# Altium schematic sheet Signal_generator.SchDoc
size A3
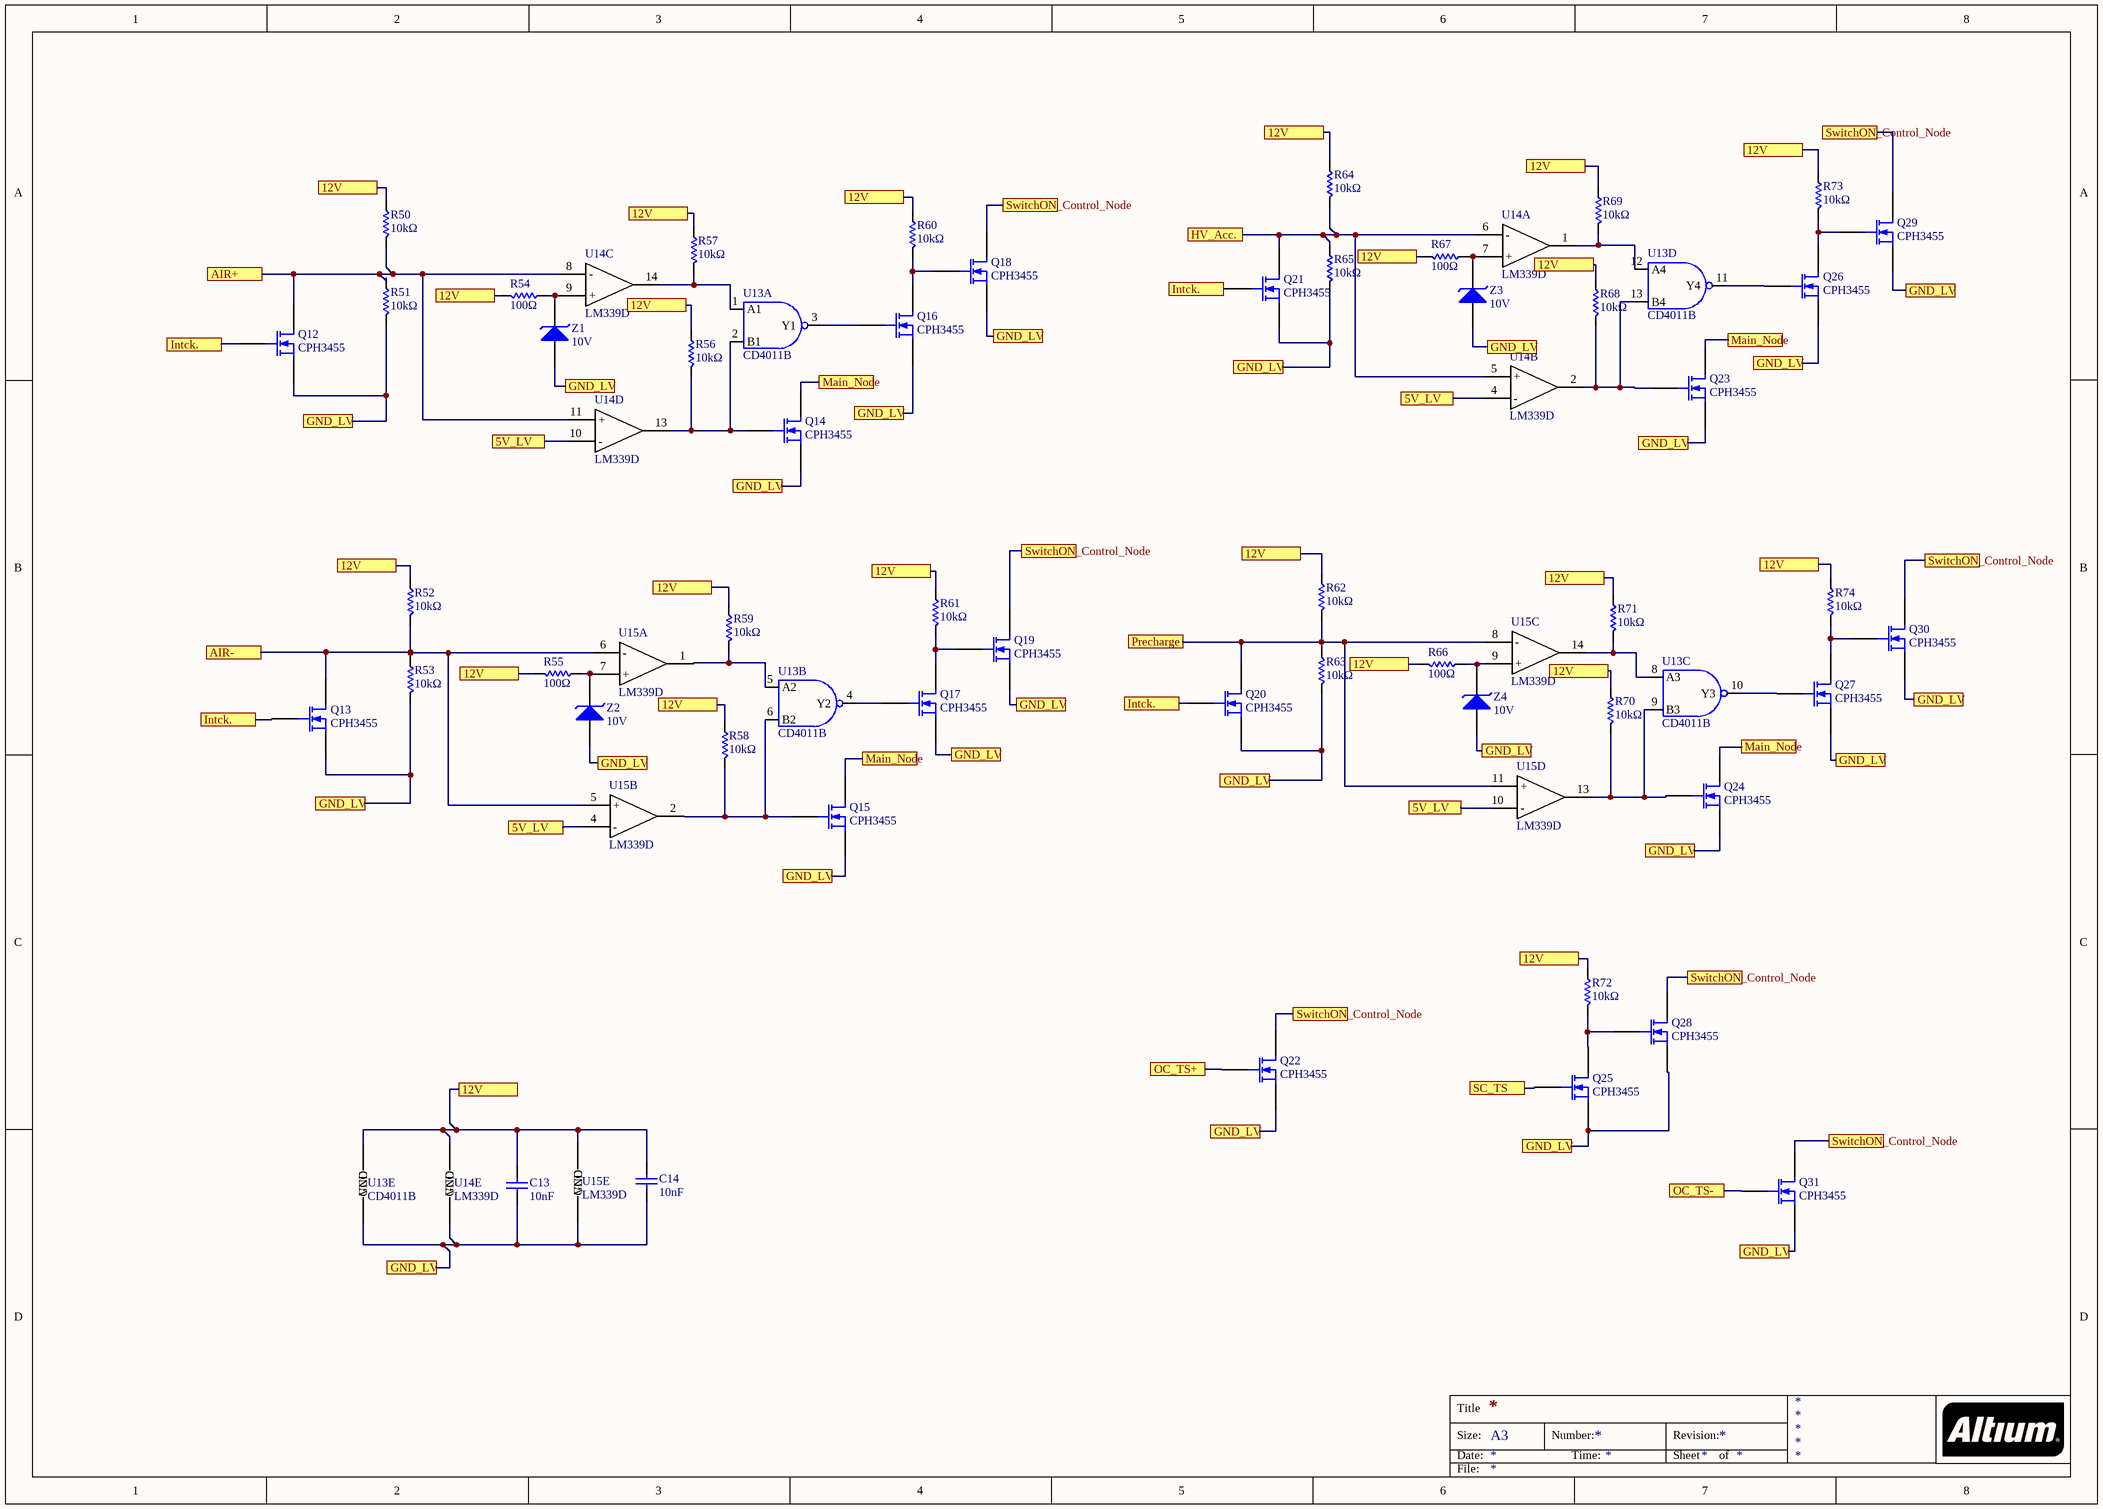
[diagram p0: Signal_generator.SchDoc]

## Parts
C13  10nF  [0805_2x1.25x0.8mm_Reflow Soldering]
C14  10nF  [0805_2x1.25x0.8mm_Reflow Soldering]
Q12  CPH3455  [CPH3455]
Q13  CPH3455  [CPH3455]
Q14  CPH3455  [CPH3455]
Q15  CPH3455  [CPH3455]
Q16  CPH3455  [CPH3455]
Q17  CPH3455  [CPH3455]
Q18  CPH3455  [CPH3455]
Q19  CPH3455  [CPH3455]
Q20  CPH3455  [CPH3455]
Q21  CPH3455  [CPH3455]
Q22  CPH3455  [CPH3455]
Q23  CPH3455  [CPH3455]
Q24  CPH3455  [CPH3455]
Q25  CPH3455  [CPH3455]
Q26  CPH3455  [CPH3455]
Q27  CPH3455  [CPH3455]
Q28  CPH3455  [CPH3455]
Q29  CPH3455  [CPH3455]
Q30  CPH3455  [CPH3455]
Q31  CPH3455  [CPH3455]
R50  10kΩ  [CR0805]
R51  10kΩ  [CR0805]
R52  10kΩ  [CR0805]
R53  10kΩ  [CR0805]
R54  100Ω  [CR0805]
R55  100Ω  [CR0805]
R56  10kΩ  [CR0805]
R57  10kΩ  [CR0805]
R58  10kΩ  [CR0805]
R59  10kΩ  [CR0805]
R60  10kΩ  [CR0805]
R61  10kΩ  [CR0805]
R62  10kΩ  [CR0805]
R63  10kΩ  [CR0805]
R64  10kΩ  [CR0805]
R65  10kΩ  [CR0805]
R66  100Ω  [CR0805]
R67  100Ω  [CR0805]
R68  10kΩ  [CR0805]
R69  10kΩ  [CR0805]
R70  10kΩ  [CR0805]
R71  10kΩ  [CR0805]
R72  10kΩ  [CR0805]
R73  10kΩ  [CR0805]
R74  10kΩ  [CR0805]
U13  CD4011B  [CD4011BM]  (parts A,B,C,D,E of 5)
U14  LM339D  [LM339D]  (parts A,B,C,D,E of 5)
U15  LM339D  [LM339D]  (parts A,B,C,D,E of 5)
Z1  10V  [MMSZ5240BT1G]
Z2  10V  [MMSZ5240BT1G]
Z3  10V  [MMSZ5240BT1G]
Z4  10V  [MMSZ5240BT1G]

## Ports
5V_LV, 12V, AIR+, AIR-, GND_LV, HV_Acc., Intck., Main_Node, OC_TS+, OC_TS-, Precharge, SC_TS, SwitchON_Control_Node

## Nets
5V_LV: U14.4(-) U14.10(-) U15.4(-) U15.10(-) ; port 5V_LV
12V: C13.2 C14.2 R50.2 R52.2 R54.1 R55.1 R56.2 R57.2 R58.2 R59.2 R60.2 R61.2 R62.2 R64.2 R66.1 R67.1 R68.2 R69.2 R70.2 R71.2 R72.2 R73.2 R74.2 U13.14(VCC) U14.3(VCC) U15.3(VCC) ; port 12V
AIR+: Q12.2(D) R50.1 R51.2 U14.8(-) U14.11(+) ; port AIR+
AIR-: Q13.2(D) R52.1 R53.2 U15.5(+) U15.6(-) ; port AIR-
GND_LV: C13.1 C14.1 Q12.3(S) Q13.3(S) Q14.3(S) Q15.3(S) Q16.3(S) Q17.3(S) Q18.3(S) Q19.3(S) Q20.3(S) Q21.3(S) Q22.3(S) Q23.3(S) Q24.3(S) Q25.3(S) Q26.3(S) Q27.3(S) Q28.3(S) Q29.3(S) Q30.3(S) Q31.3(S) R51.1 R53.1 R63.1 R65.1 U13.7(GND) U14.12(GND) U15.12(GND) Z1.2(A) Z2.2(A) Z3.2(A) Z4.2(A) ; port GND_LV
HV_Acc.: Q21.2(D) R64.1 R65.2 U14.5(+) U14.6(-) ; port HV_Acc.
Intck.: Q12.1(G) Q13.1(G) Q20.1(G) Q21.1(G) ; port Intck.
Main_Node: Q14.2(D) Q15.2(D) Q23.2(D) Q24.2(D) ; port Main_Node
OC_TS+: Q22.1(G) ; port OC_TS+
OC_TS-: Q31.1(G) ; port OC_TS-
Precharge: Q20.2(D) R62.1 R63.2 U15.8(-) U15.11(+) ; port Precharge
SC_TS: Q25.1(G) ; port SC_TS
SwitchON_Control_Node: Q18.2(D) Q19.2(D) Q22.2(D) Q28.2(D) Q29.2(D) Q30.2(D) Q31.2(D) ; port SwitchON_Control_Node
NetQ14_1: Q14.1(G) R56.1 U13.2(B1) U14.13(4OUT)
NetQ15_1: Q15.1(G) R58.1 U13.6(B2) U15.2(2OUT)
NetQ16_1: Q16.1(G) U13.3(Y1)
NetQ16_2: Q16.2(D) Q18.1(G) R60.1
NetQ17_1: Q17.1(G) U13.4(Y2)
NetQ17_2: Q17.2(D) Q19.1(G) R61.1
NetQ23_1: Q23.1(G) R68.1 U13.13(B4) U14.2(2OUT)
NetQ24_1: Q24.1(G) R70.1 U13.9(B3) U15.13(4OUT)
NetQ25_2: Q25.2(D) Q28.1(G) R72.1
NetQ26_1: Q26.1(G) U13.11(Y4)
NetQ26_2: Q26.2(D) Q29.1(G) R73.1
NetQ27_1: Q27.1(G) U13.10(Y3)
NetQ27_2: Q27.2(D) Q30.1(G) R74.1
NetR54_2: R54.2 U14.9(+) Z1.1(K)
NetR55_2: R55.2 U15.7(+) Z2.1(K)
NetR57_1: R57.1 U13.1(A1) U14.14(3OUT)
NetR59_1: R59.1 U13.5(A2) U15.1(1OUT)
NetR66_2: R66.2 U15.9(+) Z4.1(K)
NetR67_2: R67.2 U14.7(+) Z3.1(K)
NetR69_1: R69.1 U13.12(A4) U14.1(1OUT)
NetR71_1: R71.1 U13.8(A3) U15.14(3OUT)

## Notes on the sheet
- Title
- Size:
- Date:
- A3
- Number:
- Time:
- Revision:
- Sheet
- of
- File:

## Library data of the parts
C13 C14 = 885012207092: WCAP-CSGP Ceramic Capacitors, 0805, X7R, 50V, 10nF; Rated Voltage: 50V DC; ComponentLink1Description: Manufacturer; ComponentLink1URL: http://www.we-online.de; ComponentLink2Description: Datasheet; ComponentLink2URL: http://katalog.we-online.de/pbs/datasheet/885012207092.pdf; Part Number: 885012207092; Published Date: Oct. 2017; Publisher: Wurth Elektronik; Size: 0805; Operating Temperature: -55 °C to +125 °C; Value: 10nF; Ceramic Type: X7R
Q12-Q31 = CPH3455: Power MOSFET, 35V, 104 mohm, 3A, Single N-Channel; Manufacturer: ON Semiconductor; ComponentLink1Description: Datasheet; ComponentLink1URL: https://www.onsemi.com/pub/Collateral/CPH3455-D.PDF
R50-R53 R56-R65 R68-R74 = CR0805-JW-103ELF: Chip Resistor 0805; Manufacturer: Bourns; ComponentLink1Description: Datasheet; ComponentLink1URL: https://www.bourns.com/docs/product-datasheets/chpreztr.pdf?sfvrsn=566c91f1_11
R54 R55 R66 R67 = CR0805-FX-1000ELF: Chip Resistor 0805; Manufacturer: Bourns; ComponentLink1Description: Datasheet; ComponentLink1URL: https://www.bourns.com/docs/product-datasheets/chpreztr.pdf?sfvrsn=566c91f1_11
U13 = CD4011B: QUAD CMOS NAND GATES; Manufacturer: Texas Instruments; ComponentLink1Description: Datasheet; ComponentLink1URL: http://www.ti.com/lit/gpn/cd4011b
U14 U15 = LM339D: Quad Differential Comparators; Manufacturer: Texas Intstruments; ComponentLink1Description: Datasheet; ComponentLink1URL: http://www.ti.com/lit/ds/symlink/lm339.pdf
Z1-Z4 = MMSZ5240BT1G: Zener Voltage Regulators; Manufacturer: ON Semiconductor; ComponentLink1Description: Datasheet; ComponentLink1URL: https://docs-emea.rs-online.com/webdocs/14af/0900766b814af7e2.pdf